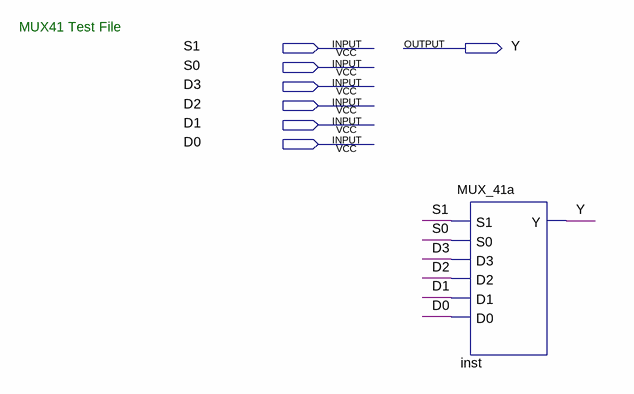
[diagram p0: schematic sheet]
// Quartus schematic MUX41.bdf as structural Verilog: 1 symbols, 7 pins
module MUX41 (
  input  S1,
  input  S0,
  input  D3,
  input  D2,
  input  D1,
  input  D0,
  output Y
);

  MUX_41a inst (.S1(S1), .S0(S0), .D3(D3), .D2(D2), .D1(D1), .D0(D0), .Y(Y));

  // Notes on the sheet:
  //   MUX41 Test File
endmodule
